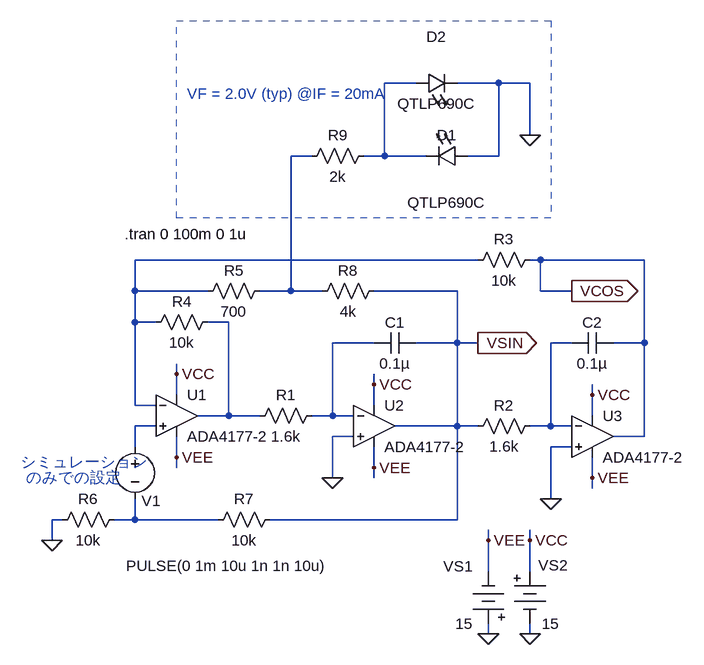
[diagram p0: schematic fig-01-03-10.asc]
fig-01-03-10.asc, the LTspice schematic file:
Version 4
SHEET 1 1284 860
WIRE 576 -336 528 -336
WIRE 704 -336 640 -336
WIRE 752 -336 704 -336
WIRE 752 -256 752 -336
WIRE 416 -224 384 -224
WIRE 528 -224 528 -336
WIRE 528 -224 496 -224
WIRE 592 -224 528 -224
WIRE 704 -224 704 -336
WIRE 704 -224 656 -224
WIRE 672 -64 144 -64
WIRE 768 -64 752 -64
WIRE 928 -64 768 -64
WIRE 144 -16 144 -64
WIRE 256 -16 144 -16
WIRE 384 -16 384 -224
WIRE 384 -16 336 -16
WIRE 432 -16 384 -16
WIRE 640 -16 512 -16
WIRE 768 -16 768 -64
WIRE 816 -16 768 -16
WIRE 144 32 144 -16
WIRE 176 32 144 32
WIRE 288 32 256 32
WIRE 512 64 448 64
WIRE 640 64 640 -16
WIRE 640 64 576 64
WIRE 672 64 640 64
WIRE 816 64 784 64
WIRE 928 64 928 -64
WIRE 928 64 880 64
WIRE 208 112 208 96
WIRE 512 128 512 112
WIRE 208 144 208 112
WIRE 848 144 848 128
WIRE 144 160 144 32
WIRE 176 160 144 160
WIRE 512 160 512 128
WIRE 288 176 288 32
WIRE 288 176 240 176
WIRE 336 176 288 176
WIRE 448 176 448 64
WIRE 448 176 416 176
WIRE 480 176 448 176
WIRE 848 176 848 144
WIRE 176 192 144 192
WIRE 640 192 640 64
WIRE 640 192 544 192
WIRE 672 192 640 192
WIRE 784 192 784 64
WIRE 784 192 752 192
WIRE 816 192 784 192
WIRE 480 208 448 208
WIRE 928 208 928 64
WIRE 928 208 880 208
WIRE 144 224 144 192
WIRE 816 224 784 224
WIRE 208 240 208 208
WIRE 208 256 208 240
WIRE 512 256 512 224
WIRE 448 272 448 208
WIRE 512 272 512 256
WIRE 848 272 848 240
WIRE 848 288 848 272
WIRE 784 304 784 224
WIRE 32 336 16 336
WIRE 144 336 144 304
WIRE 144 336 112 336
WIRE 272 336 144 336
WIRE 640 336 640 192
WIRE 640 336 352 336
WIRE 16 368 16 336
WIRE 688 368 688 352
WIRE 752 368 752 352
WIRE 688 416 688 368
WIRE 752 416 752 368
WIRE 688 512 688 496
WIRE 752 512 752 496
FLAG 688 512 0
FLAG 752 512 0
FLAG 688 368 VEE
FLAG 752 368 VCC
FLAG 208 112 VCC
FLAG 208 240 VEE
FLAG 512 128 VCC
FLAG 512 256 VEE
FLAG 848 144 VCC
FLAG 848 272 VEE
FLAG 784 304 0
FLAG 16 368 0
FLAG 448 272 0
FLAG 672 64 VSIN
IOPIN 672 64 Out
FLAG 816 -16 VCOS
IOPIN 816 -16 Out
FLAG 752 -256 0
SYMBOL res 432 160 R90
WINDOW 0 0 56 VBottom 2
WINDOW 3 32 56 VTop 2
SYMATTR InstName R1
SYMATTR Value 1.6k
SYMBOL res 368 320 R90
WINDOW 0 0 56 VBottom 2
WINDOW 3 32 56 VTop 2
SYMATTR InstName R7
SYMATTR Value 10k
SYMBOL res 272 16 R90
WINDOW 0 0 56 VBottom 2
WINDOW 3 32 56 VTop 2
SYMATTR InstName R4
SYMATTR Value 10k
SYMBOL cap 512 80 R270
WINDOW 0 32 32 VTop 2
WINDOW 3 0 32 VBottom 2
SYMATTR InstName C1
SYMATTR Value 0.1µ
SYMBOL Misc\\battery 752 400 R0
WINDOW 0 13 6 Left 2
WINDOW 3 18 96 Left 2
SYMATTR InstName VS2
SYMATTR Value 15
SYMBOL Misc\\battery 688 512 R180
WINDOW 0 24 104 Left 2
WINDOW 3 24 16 Left 2
SYMATTR InstName VS1
SYMATTR Value 15
SYMBOL res 128 320 R90
WINDOW 0 0 56 VBottom 2
WINDOW 3 32 56 VTop 2
SYMATTR InstName R6
SYMATTR Value 10k
SYMBOL res 768 176 R90
WINDOW 0 0 56 VBottom 2
WINDOW 3 32 56 VTop 2
SYMATTR InstName R2
SYMATTR Value 1.6k
SYMBOL cap 880 48 R90
WINDOW 0 0 32 VBottom 2
WINDOW 3 32 32 VTop 2
SYMATTR InstName C2
SYMATTR Value 0.1µ
SYMBOL res 768 -80 R90
WINDOW 0 0 56 VBottom 2
WINDOW 3 32 56 VTop 2
SYMATTR InstName R3
SYMATTR Value 10k
SYMBOL res 240 0 R270
WINDOW 0 32 56 VTop 2
WINDOW 3 0 56 VBottom 2
SYMATTR InstName R5
SYMATTR Value 700
SYMBOL voltage 144 208 R0
WINDOW 0 10 99 Left 2
WINDOW 3 -14 199 Left 2
WINDOW 123 0 0 Left 0
WINDOW 39 0 0 Left 0
SYMATTR InstName V1
SYMATTR Value PULSE(0 1m 10u 1n 1n 10u)
SYMBOL LED 656 -240 R90
WINDOW 0 0 32 VBottom 2
WINDOW 3 72 32 VTop 2
SYMATTR InstName D1
SYMATTR Value QTLP690C
SYMATTR Description Diode
SYMATTR Type diode
SYMBOL res 528 -32 R90
WINDOW 0 0 56 VBottom 2
WINDOW 3 32 56 VTop 2
SYMATTR InstName R8
SYMATTR Value 4k
SYMBOL LED 576 -320 R270
WINDOW 0 72 32 VTop 2
WINDOW 3 0 32 VBottom 2
SYMATTR InstName D2
SYMATTR Value QTLP690C
SYMATTR Description Diode
SYMATTR Type diode
SYMBOL res 512 -240 R90
WINDOW 0 0 56 VBottom 2
WINDOW 3 32 56 VTop 2
SYMATTR InstName R9
SYMATTR Value 2k
SYMBOL Opamps\\ADA4177-2 208 176 R0
SYMATTR InstName U1
SYMBOL Opamps\\ADA4177-2 512 192 R0
SYMATTR InstName U2
SYMBOL Opamps\\ADA4177-2 848 208 R0
SYMATTR InstName U3
TEXT 128 -104 Left 2 !.tran 0 100m 0 1u
TEXT -24 272 Left 2 ;のみでの設定
TEXT -32 248 Left 2 ;シミュレーション
TEXT 224 -320 Left 2 ;VF = 2.0V (typ) @IF = 20mA
RECTANGLE Normal 784 -128 208 -432 2

The netlist it stands for:
* fig-01-03-10.asc
R1 N005 N004 1.6k
R7 VSIN N008 10k
R4 N004 N003 10k
C1 N005 VSIN 0.1µ
VS2 VCC 0 15
VS1 0 VEE 15
R6 N008 0 10k
R2 N006 VSIN 1.6k
C2 VCOS N006 0.1µ
R3 VCOS N003 10k
R5 N003 N002 700
V1 N007 N008 PULSE(0 1m 10u 1n 1n 10u)
D1 0 N001 QTLP690C
R8 VSIN N002 4k
D2 N001 0 QTLP690C
R9 N001 N002 2k
* U1: ADA4177-2 (symbol Opamps\ADA4177-2 not available, pins judged from their places): In+=N007 In-=N003 V+=VCC V-=VEE OUT=N004
* U2: ADA4177-2 (symbol Opamps\ADA4177-2 not available, pins judged from their places): In+=0 In-=N005 V+=VCC V-=VEE OUT=VSIN
* U3: ADA4177-2 (symbol Opamps\ADA4177-2 not available, pins judged from their places): In+=0 In-=N006 V+=VCC V-=VEE OUT=VCOS
.model D D
.lib standard.dio
.tran 0 100m 0 1u
* のみでの設定
* シミュレーション
* VF = 2.0V (typ) @IF = 20mA
.backanno
.end